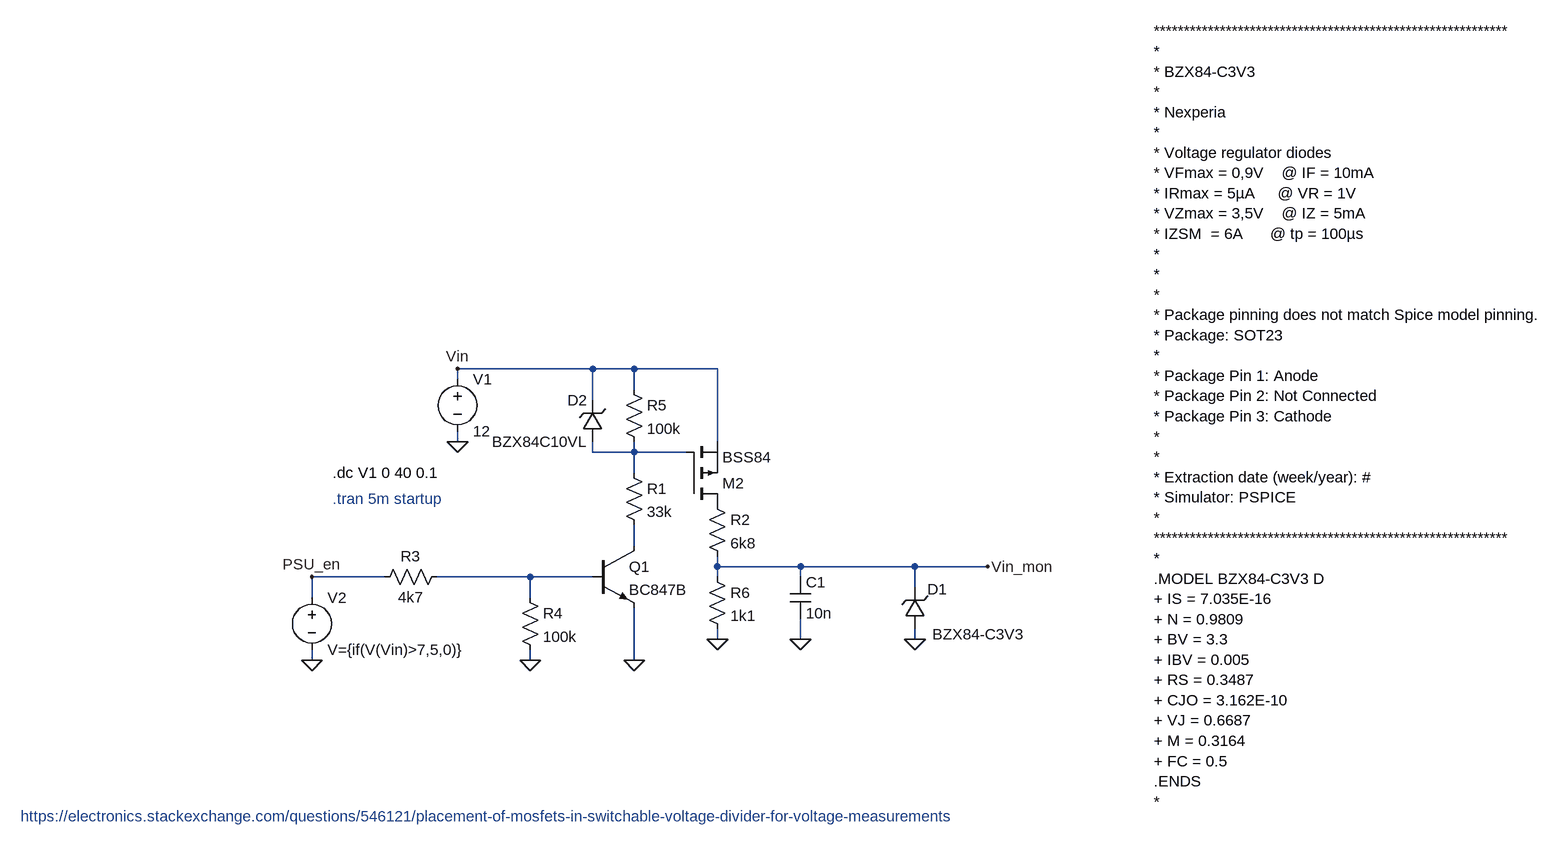
[diagram p0: schematic Vin_mon.asc]
Vin_mon.asc, the LTspice schematic file:
Version 4
SHEET 1 3136 1344
WIRE 128 96 -80 96
WIRE 192 96 128 96
WIRE 320 96 192 96
WIRE -80 112 -80 96
WIRE 192 128 192 96
WIRE 128 144 128 96
WIRE -80 208 -80 192
WIRE 320 208 320 96
WIRE 128 224 128 208
WIRE 192 224 192 208
WIRE 192 224 128 224
WIRE 272 224 192 224
WIRE 192 256 192 224
WIRE 192 368 192 336
WIRE 320 400 320 384
WIRE 448 400 320 400
WIRE 624 400 448 400
WIRE 736 400 624 400
WIRE -192 416 -304 416
WIRE 32 416 -112 416
WIRE 128 416 32 416
WIRE 320 416 320 400
WIRE 448 416 448 400
WIRE 624 432 624 400
WIRE -304 448 -304 416
WIRE 32 448 32 416
WIRE 320 512 320 496
WIRE 448 512 448 480
WIRE 624 512 624 496
WIRE -304 544 -304 528
WIRE 32 544 32 528
WIRE 192 544 192 464
FLAG 32 544 0
FLAG 192 544 0
FLAG -304 544 0
FLAG -80 208 0
FLAG 736 400 Vin_mon
FLAG 448 512 0
FLAG 624 512 0
FLAG 320 512 0
FLAG -304 416 PSU_en
FLAG -80 96 Vin
SYMBOL res 176 240 R0
SYMATTR InstName R1
SYMATTR Value 33k
SYMBOL voltage -80 96 R0
WINDOW 123 0 0 Left 0
WINDOW 39 0 0 Left 0
SYMATTR InstName V1
SYMATTR Value 12
SYMBOL voltage -304 432 R0
SYMATTR InstName V2
SYMATTR Value V={if(V(Vin)>7,5,0)}
SYMATTR Prefix B
SYMBOL res -208 432 R270
WINDOW 0 32 56 VTop 2
WINDOW 3 0 56 VBottom 2
SYMATTR InstName R3
SYMATTR Value 4k7
SYMBOL res 16 432 R0
SYMATTR InstName R4
SYMATTR Value 100k
SYMBOL pmos 272 304 M180
SYMATTR InstName M2
SYMATTR Value BSS84
SYMBOL npn 128 368 R0
SYMATTR InstName Q1
SYMATTR Value BC847B
SYMBOL cap 432 416 R0
SYMATTR InstName C1
SYMATTR Value 10n
SYMBOL zener 640 496 R180
WINDOW 0 -34 61 Left 2
WINDOW 3 -153 -8 Left 2
SYMATTR InstName D1
SYMATTR Value BZX84-C3V3
SYMBOL res 304 288 R0
SYMATTR InstName R2
SYMATTR Value 6k8
SYMBOL res 304 400 R0
SYMATTR InstName R6
SYMATTR Value 1k1
SYMBOL zener 144 208 R180
WINDOW 0 24 64 Left 2
WINDOW 3 24 0 Left 2
SYMATTR InstName D2
SYMATTR Value BZX84C10VL
SYMBOL res 176 112 R0
SYMATTR InstName R5
SYMATTR Value 100k
TEXT -272 256 Left 2 !.dc V1 0 40 0.1
TEXT -272 296 Left 2 ;.tran 5m startup
TEXT -752 784 Left 2 ;https://electronics.stackexchange.com/questions/546121/placement-of-mosfets-in-switchable-voltage-divider-for-voltage-measurements
TEXT 992 -424 Left 2 !***********************************************************\n*\n* BZX84-C3V3\n*\n* Nexperia\n*\n* Voltage regulator diodes\n* VFmax = 0,9V    @ IF = 10mA\n* IRmax = 5µA     @ VR = 1V\n* VZmax = 3,5V    @ IZ = 5mA\n* IZSM  = 6A      @ tp = 100µs\n*\n*\n*\n* Package pinning does not match Spice model pinning.\n* Package: SOT23\n*\n* Package Pin 1: Anode\n* Package Pin 2: Not Connected\n* Package Pin 3: Cathode\n*\n*\n* Extraction date (week/year): #\n* Simulator: PSPICE\n*\n***********************************************************\n*\n.MODEL BZX84-C3V3 D\n+ IS = 7.035E-16\n+ N = 0.9809\n+ BV = 3.3\n+ IBV = 0.005\n+ RS = 0.3487\n+ CJO = 3.162E-10\n+ VJ = 0.6687\n+ M = 0.3164\n+ FC = 0.5\n.ENDS\n*

The netlist it stands for:
* Vin_mon.asc
R1 N001 N002 33k
V1 Vin 0 12
B§V2 PSU_en 0 V={if(V(Vin)>7,5,0)}
R3 PSU_en N003 4k7
R4 N003 0 100k
M2 P001 N001 Vin Vin BSS84
Q1 N002 N003 0 0 BC847B
C1 Vin_mon 0 10n
D1 0 Vin_mon BZX84-C3V3
R2 P001 Vin_mon 6k8
R6 Vin_mon 0 1k1
D2 N001 Vin BZX84C10VL
R5 Vin N001 100k
.model D D
.lib standard.dio
.model NPN NPN
.model PNP PNP
.lib standard.bjt
.model NMOS NMOS
.model PMOS PMOS
.lib standard.mos
.dc V1 0 40 0.1
* .tran 5m startup
* https://electronics.stackexchange.com/questions/546121/placement-of-mosfets-in-switchable-voltage-divider-for-voltage-measurements
***********************************************************
*
* BZX84-C3V3
*
* Nexperia
*
* Voltage regulator diodes
* VFmax = 0,9V    @ IF = 10mA
* IRmax = 5µA     @ VR = 1V
* VZmax = 3,5V    @ IZ = 5mA
* IZSM  = 6A      @ tp = 100µs
*
*
*
* Package pinning does not match Spice model pinning.
* Package: SOT23
*
* Package Pin 1: Anode
* Package Pin 2: Not Connected
* Package Pin 3: Cathode
*
*
* Extraction date (week/year): #
* Simulator: PSPICE
*
***********************************************************
*
.MODEL BZX84-C3V3 D
+ IS = 7.035E-16
+ N = 0.9809
+ BV = 3.3
+ IBV = 0.005
+ RS = 0.3487
+ CJO = 3.162E-10
+ VJ = 0.6687
+ M = 0.3164
+ FC = 0.5
.ENDS
*
.backanno
.end